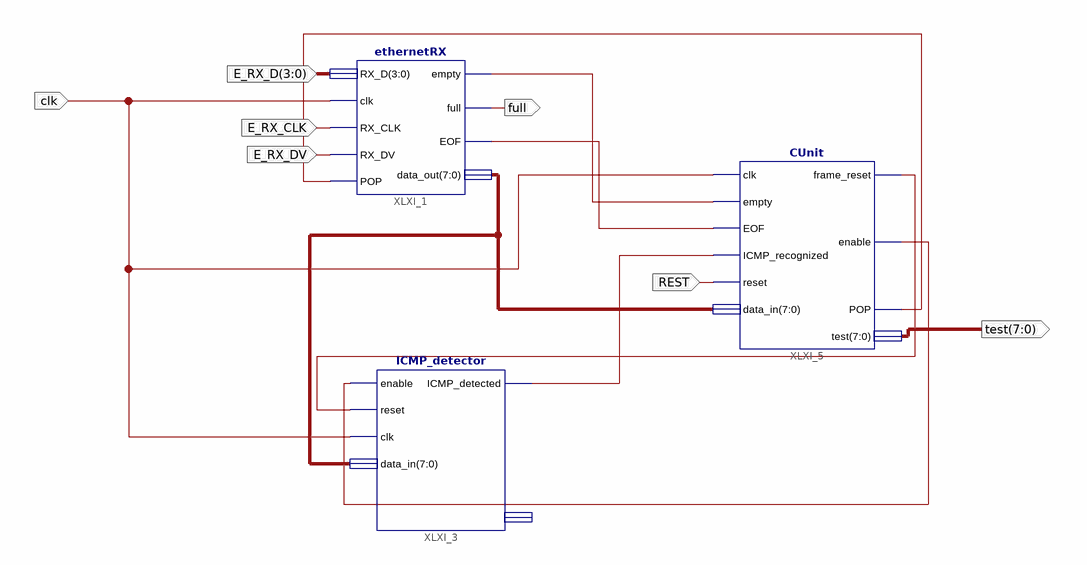
[diagram p0: schematic sheet 1]
// Xilinx ISE schematic CU_test1.sch (spartan3e) as structural Verilog: 3 symbols, 7 ports
module CU_test1 (
  input  clk,
  input  [3:0] E_RX_D,
  input  E_RX_CLK,
  input  E_RX_DV,
  input  REST,
  output full,
  output [7:0] test
);

  wire XLXN_12, XLXN_13, XLXN_14, XLXN_15, XLXN_16, XLXN_17;
  wire [7:0] XLXN_9;

  ethernetRX XLXI_1 (
    .RX_D(E_RX_D), .clk(clk), .RX_CLK(E_RX_CLK), .RX_DV(E_RX_DV), .POP(XLXN_16), .empty(XLXN_15),
    .full(full), .EOF(XLXN_14), .data_out(XLXN_9));
  ICMP_detector XLXI_3 (
    .enable(XLXN_12), .reset(XLXN_17), .clk(clk), .data_in(XLXN_9), .ICMP_detected(XLXN_13));  // open: test
  CUnit XLXI_5 (
    .clk(clk), .empty(XLXN_15), .EOF(XLXN_14), .ICMP_recognized(XLXN_13), .reset(REST), .data_in(XLXN_9),
    .frame_reset(XLXN_17), .enable(XLXN_12), .POP(XLXN_16), .test(test));
endmodule
